# Altium schematic sheet FMC_connector_GH.SchDoc: FMC Connector GH
size A; Author: James Thomas; CompanyName: BYUI; DrawnBy: James Thomas; Engineer: James Thomas; Organization: CSEE; DocumentNumber: 13; Revision: 0.0.1; SheetNumber: 13; SheetTotal: 15
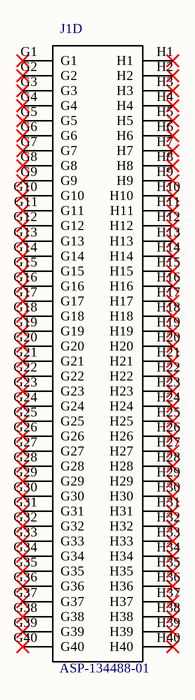
[diagram p0: FMC_connector_GH.SchDoc]

## Parts
J1  ASP-134488-01  [*SAMTEC_ASP-134488-01_ASP-134488-01(Primary)]  (part D of 5)

## Nets

Not connected (* = marked no-connect by the designer): J1 G1* G2* G3* G4* G5* G6* G7* G8* G9* G10* G11* G12* G13* G14* G15* G16* G17* G18* G19* G20* G21* G22* G23* G24* G25* G26* G27* G28* G29* G30* G31* G32* G33* G34* G35* G36* G37* G38* G39* G40* H1* H2* H3* H4* H5* H6* H7* H8* H9* H10* H11* H12* H13* H14* H15* H16* H17* H18* H19* H20* H21* H22* H23* H24* H25* H26* H27* H28* H29* H30* H31* H32* H33* H34* H35* H36* H37* H38* H39* H40*

## Library data of the parts
J1 = ASP-134488-01: SnapEDA_Link: https://www.snapeda.com/parts/ASP-134488-01/Samtec%20Inc./view-part/423215/?ref=snap; Value: *